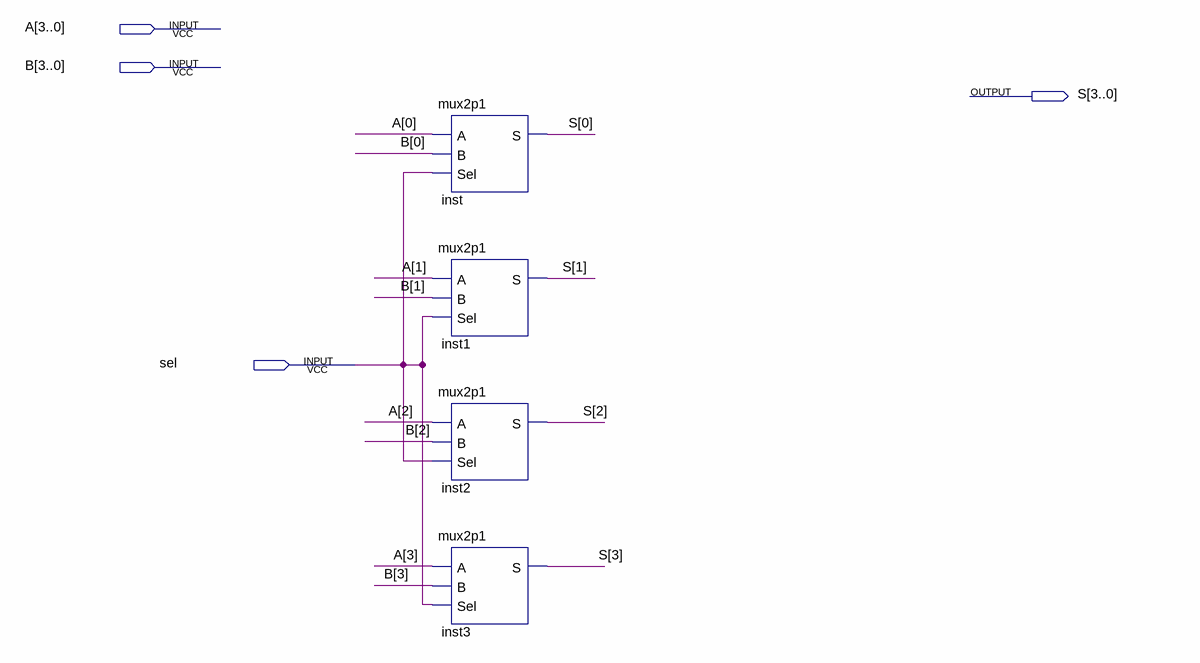
[diagram p0: schematic sheet]
// Quartus schematic mux4b.bdf as structural Verilog: 4 symbols, 4 pins
module mux4b (
  input  [3:0] A,
  input  [3:0] B,
  input  sel,
  output [3:0] S
);

  mux2p1 inst (.A(A[0]), .B(B[0]), .Sel(sel), .S(S[0]));
  mux2p1 inst1 (.A(A[1]), .B(B[1]), .Sel(sel), .S(S[1]));
  mux2p1 inst2 (.A(A[2]), .B(B[2]), .Sel(sel), .S(S[2]));
  mux2p1 inst3 (.A(A[3]), .B(B[3]), .Sel(sel), .S(S[3]));
endmodule
